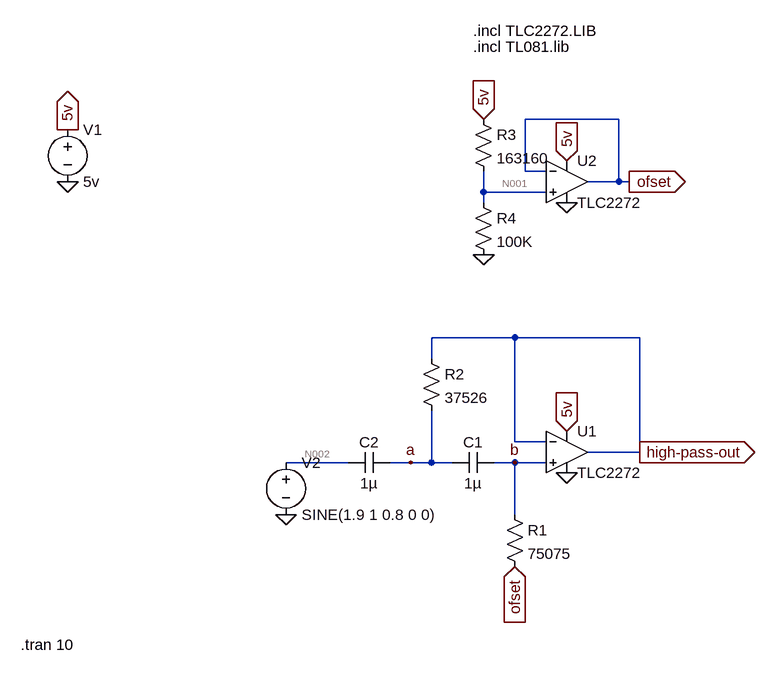
[diagram p0: schematic Draft1.asc]
Draft1.asc, the LTspice schematic file:
Version 4
SHEET 1 880 680
WIRE 400 -384 256 -384
WIRE 256 -304 256 -384
WIRE 288 -304 256 -304
WIRE 400 -288 400 -384
WIRE 400 -288 352 -288
WIRE 416 -288 400 -288
WIRE 192 -272 192 -304
WIRE 288 -272 192 -272
WIRE 192 -256 192 -272
WIRE 240 -48 112 -48
WIRE 432 -48 240 -48
WIRE 112 -16 112 -48
WIRE 240 112 240 -48
WIRE 288 112 240 112
WIRE 432 128 432 -48
WIRE 432 128 352 128
WIRE -16 144 -112 144
WIRE 80 144 48 144
WIRE 112 144 112 64
WIRE 112 144 80 144
WIRE 144 144 112 144
WIRE 240 144 208 144
WIRE 288 144 240 144
WIRE 240 224 240 144
FLAG 320 96 5v
IOPIN 320 96 In
FLAG 320 160 0
FLAG 432 128 high-pass-out
IOPIN 432 128 Out
FLAG 240 304 ofset
IOPIN 240 304 In
FLAG 80 144 a
FLAG 240 144 b
FLAG 192 -384 5v
IOPIN 192 -384 In
FLAG 192 -176 0
FLAG 416 -288 ofset
IOPIN 416 -288 Out
FLAG 320 -256 0
FLAG 320 -320 5v
IOPIN 320 -320 In
FLAG -448 -288 0
FLAG -448 -368 5v
IOPIN -448 -368 Out
FLAG -112 224 0
SYMBOL Opamps\\opamp2 320 64 R0
SYMATTR InstName U1
SYMATTR Value TLC2272
SYMBOL res 224 208 R0
SYMATTR InstName R1
SYMATTR Value 75075
SYMBOL res 96 -32 R0
SYMATTR InstName R2
SYMATTR Value 37526
SYMBOL cap 208 128 R90
WINDOW 0 0 32 VBottom 2
WINDOW 3 32 32 VTop 2
SYMATTR InstName C1
SYMATTR Value 1µ
SYMBOL cap 48 128 R90
WINDOW 0 0 32 VBottom 2
WINDOW 3 32 32 VTop 2
SYMATTR InstName C2
SYMATTR Value 1µ
SYMBOL res 176 -400 R0
SYMATTR InstName R3
SYMATTR Value 163160
SYMBOL res 176 -272 R0
SYMATTR InstName R4
SYMATTR Value 100K
SYMBOL Opamps\\opamp2 320 -352 R0
SYMATTR InstName U2
SYMATTR Value TLC2272
SYMBOL voltage -448 -384 R0
WINDOW 123 0 0 Left 0
WINDOW 39 0 0 Left 0
SYMATTR InstName V1
SYMATTR Value 5v
SYMBOL voltage -112 128 R0
WINDOW 123 0 0 Left 0
WINDOW 39 0 0 Left 0
SYMATTR InstName V2
SYMATTR Value SINE(1.9 1 0.8 0 0)
TEXT 176 -520 Left 2 !.incl TLC2272.LIB
TEXT 176 -496 Left 2 !.incl TL081.lib
TEXT -520 424 Left 2 !.tran 10

The netlist it stands for:
* Draft1.asc
XU1 b high-pass-out 5v 0 high-pass-out TLC2272  ; pins In+ In- V+ V- OUT
R1 b ofset 75075
R2 high-pass-out a 37526
C1 b a 1µ
C2 a N002 1µ
R3 5v N001 163160
R4 N001 0 100K
XU2 N001 ofset 5v 0 ofset TLC2272  ; pins In+ In- V+ V- OUT
V1 5v 0 5v
V2 N002 0 SINE(1.9 1 0.8 0 0)
.incl TLC2272.LIB
.incl TL081.lib
.tran 10
.backanno
.end

* Results of the author's LTspice run, read from the files saved beside the schematic
* Operating Point, zero values left out:
*   V(high-pass-out) = 1.9 V
*   V(5v) = 5 V
*   V(b) = 1.9 V
*   V(ofset) = 1.9 V
*   V(a) = 1.9 V
*   V(n002) = 1.9 V
*   V(n001) = 1.9 V
*   I(R4) = 19 µA
*   I(R3) = 19 µA
*   I(R1) = 1.848 pA
*   I(V1) = -4.819 mA
*   Ix(u1:IN+) = -1.865 pA
*   Ix(u1:IN-) = -2.487 pA
*   Ix(u1:VCC) = 2.4 mA
*   Ix(u1:VEE) = -2.4 mA
*   Ix(u1:OUT) = 2.48 pA
*   Ix(u2:IN+) = -1.865 pA
*   Ix(u2:IN-) = -2.487 pA
*   Ix(u2:VCC) = 2.4 mA
*   Ix(u2:VEE) = -2.4 mA
*   Ix(u2:OUT) = 4.326 pA
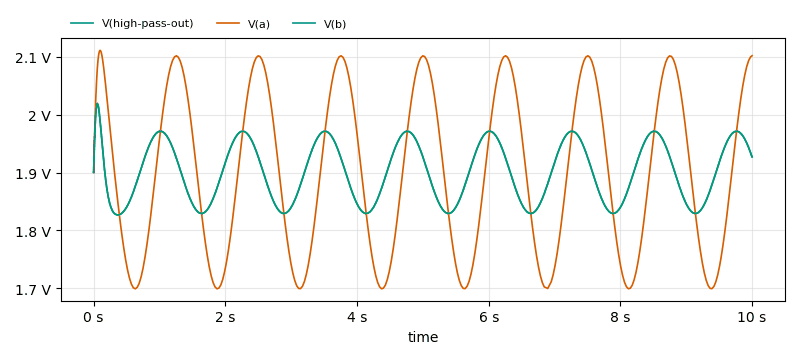
[diagram p1: Transient Analysis of Draft1.asc, plotted from the saved traces]
* Transient Analysis, 1 run:
*   V(high-pass-out): min 1.827 V, max 2.02 V, average 1.902 V, rms 1.902 V, last 1.927 V
*   V(a): min 1.699 V, max 2.111 V, average 1.9 V, rms 1.906 V, last 2.101 V
*   V(b): min 1.827 V, max 2.018 V, average 1.901 V, rms 1.902 V, last 1.927 V